# Altium schematic sheet ADS-228.SchDoc
size A4
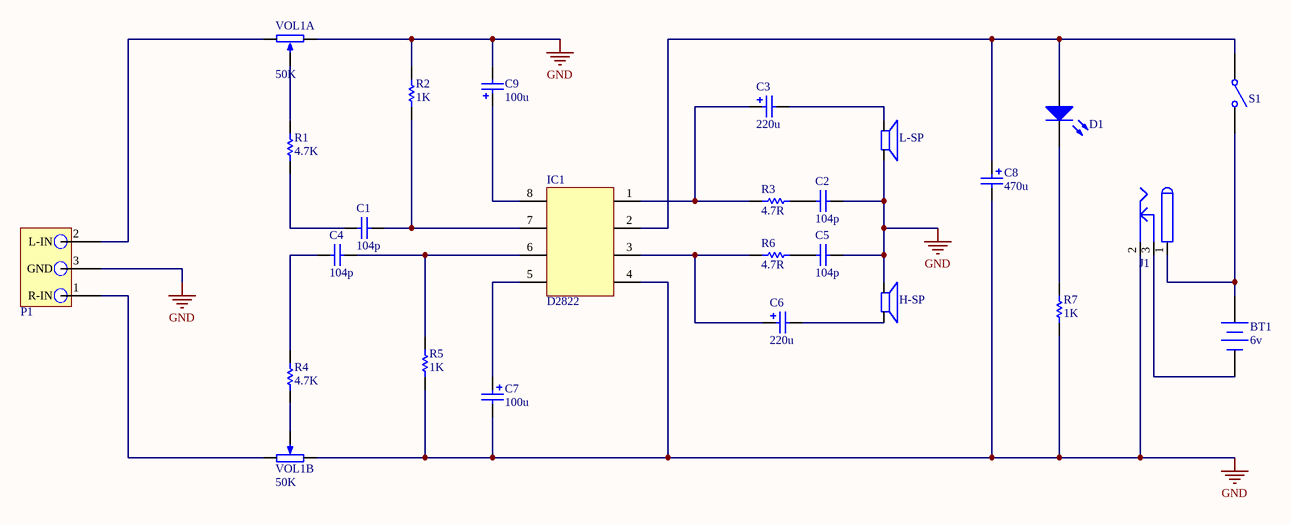
[diagram p0: ADS-228.SchDoc]

## Parts
BT1  6v  [BAT]
C1  value 104p  [RAD3]  (hidden comment: Cap)
C2  value 104p  [RAD3]  (hidden comment: Cap)
C3  value 220u  [CAPPR3-5]  (hidden comment: Cap Pol1)
C4  value 104p  [RAD3]  (hidden comment: Cap)
C5  value 104p  [RAD3]  (hidden comment: Cap)
C6  value 220u  [CAPPR3-5]  (hidden comment: Cap Pol1)
C7  value 100u  [CAPPR4-6]  (hidden comment: Cap Pol1)
C8  value 470u  [CAPPR4-6]  (hidden comment: Cap Pol1)
C9  value 100u  [CAPPR3-5]  (hidden comment: Cap Pol1)
D1  LED1  [LED]  (value not drawn)
H-SP  SPEAKER  [SPAKER2]  (value not drawn)
IC1  D2822  [DIP8]
J1  PWR2.5  [DC]  (value not drawn)
L-SP  SPEAKER  [SPAKER2]  (value not drawn)
P1  PLUG  [HDR1X3]  (value not drawn)
R1  value 4.7K  [AXIAL3]  (hidden comment: Res1)
R2  value 1K  [AXIAL3]  (hidden comment: Res1)
R3  value 4.7R  [AXIAL3]  (hidden comment: Res1)
R4  value 4.7K  [AXIAL3]  (hidden comment: Res1)
R5  value 1K  [AXIAL3.8]  (hidden comment: Res1)
R6  value 4.7R  [AXIAL3]  (hidden comment: Res1)
R7  value 1K  [AXIAL5]  (hidden comment: Res1)
S1  SW-SPST  [SW]  (value not drawn)
VOL1  value 50K  [VR]  (hidden comment: RPOT)  (parts A,B of 2)

## Nets
GND: C2.2 C5.2 C7.2 C8.2 C9.2 H-SP.1 IC1.4 J1.2 L-SP.2 P1.3(GND) R2.2 R5.1 R7.1 S1.0(GND) VOL1.0(GND) VOL1.2
NetBT1_1: BT1.1(+) J1.1 S1.2
NetBT1_2: BT1.2(-) J1.3
NetC1_1: C1.1 R1.1
NetC1_2: C1.2 IC1.7 R2.1
NetC2_1: C2.1 R3.2
NetC3_1: C3.1 IC1.1 R3.1
NetC3_2: C3.2 L-SP.1
NetC4_1: C4.1 R4.2
NetC4_2: C4.2 IC1.6 R5.2
NetC5_1: C5.1 R6.2
NetC6_1: C6.1 IC1.3 R6.1
NetC6_2: C6.2 H-SP.2
NetC7_1: C7.1 IC1.5
NetC8_1: C8.1 D1.1(A) IC1.2 S1.1
NetC9_1: C9.1 IC1.8
NetD1_2: D1.2(K) R7.2
NetP1_1: P1.1(R-IN) VOL1.4
NetP1_2: P1.2(L-IN) VOL1.1
NetR1_2: R1.2 VOL1.3
NetR4_1: R4.1 VOL1.5

## Library data of the parts
BT1 = Battery: Multicell Battery; Published: 24-Mar-1999; LatestRevisionDate: 17-Jul-2002; LatestRevisionNote: Re-released for DXP Platform.; PackageReference: BAT-2; Publisher: Altium Limited
C1 C2 C4 C5 = Cap: Capacitor; Published: 8-Jun-2000; LatestRevisionDate: 17-Jul-2002; LatestRevisionNote: Re-released for DXP Platform.; PackageReference: RAD-0.3; Publisher: Altium Limited
C3 C6-C9 = Cap Pol1: Polarized Capacitor (Radial); Published: 8-Jun-2000; LatestRevisionDate: 17-Jul-2002; LatestRevisionNote: Re-released for DXP Platform.; PackageReference: RB7.6-15; Publisher: Altium Limited
D1 = LED1: Typical RED GaAs LED; Published: 8-Jun-2000; LatestRevisionDate: 08-Jul-2005; LatestRevisionNote: Mech Layer 1 removed.; PackageReference: LED-1; Publisher: Altium Limited
J1 = PWR2.5: Low Voltage Power Supply Connector; Published: 17-Dec-2003; DatasheetDocument: 09-May-2002; Publisher: Altium Limited; ComponentLink1Description: Manufacturer Link; ComponentLink1URL: http://domino.kycon.com/internet/Products.html
R1-R7 = Res1: Resistor; Published: 8-Jun-2000; LatestRevisionDate: 17-Jul-2002; LatestRevisionNote: Re-released for DXP Platform.; PackageReference: AXIAL-0.3; Publisher: Altium Limited
S1 = SW-SPST: Single-Pole, Single-Throw Switch; Published: 24-Mar-1999; LatestRevisionDate: 17-Jul-2002; LatestRevisionNote: Re-released for DXP Platform.; PackageReference: SPST-2; Publisher: Altium Limited